# EasyEDA Pro project Schematic.epro

# Schematic Schematic1
Board Name: Board1; Create Date: 2026-04-01; Page Name: P1; Project Name: Microphone; Schematic Name: Schematic1; Update Date: 2026-04-01; Company: EasyEDA.com; Page Size: A4; Version: V1.0
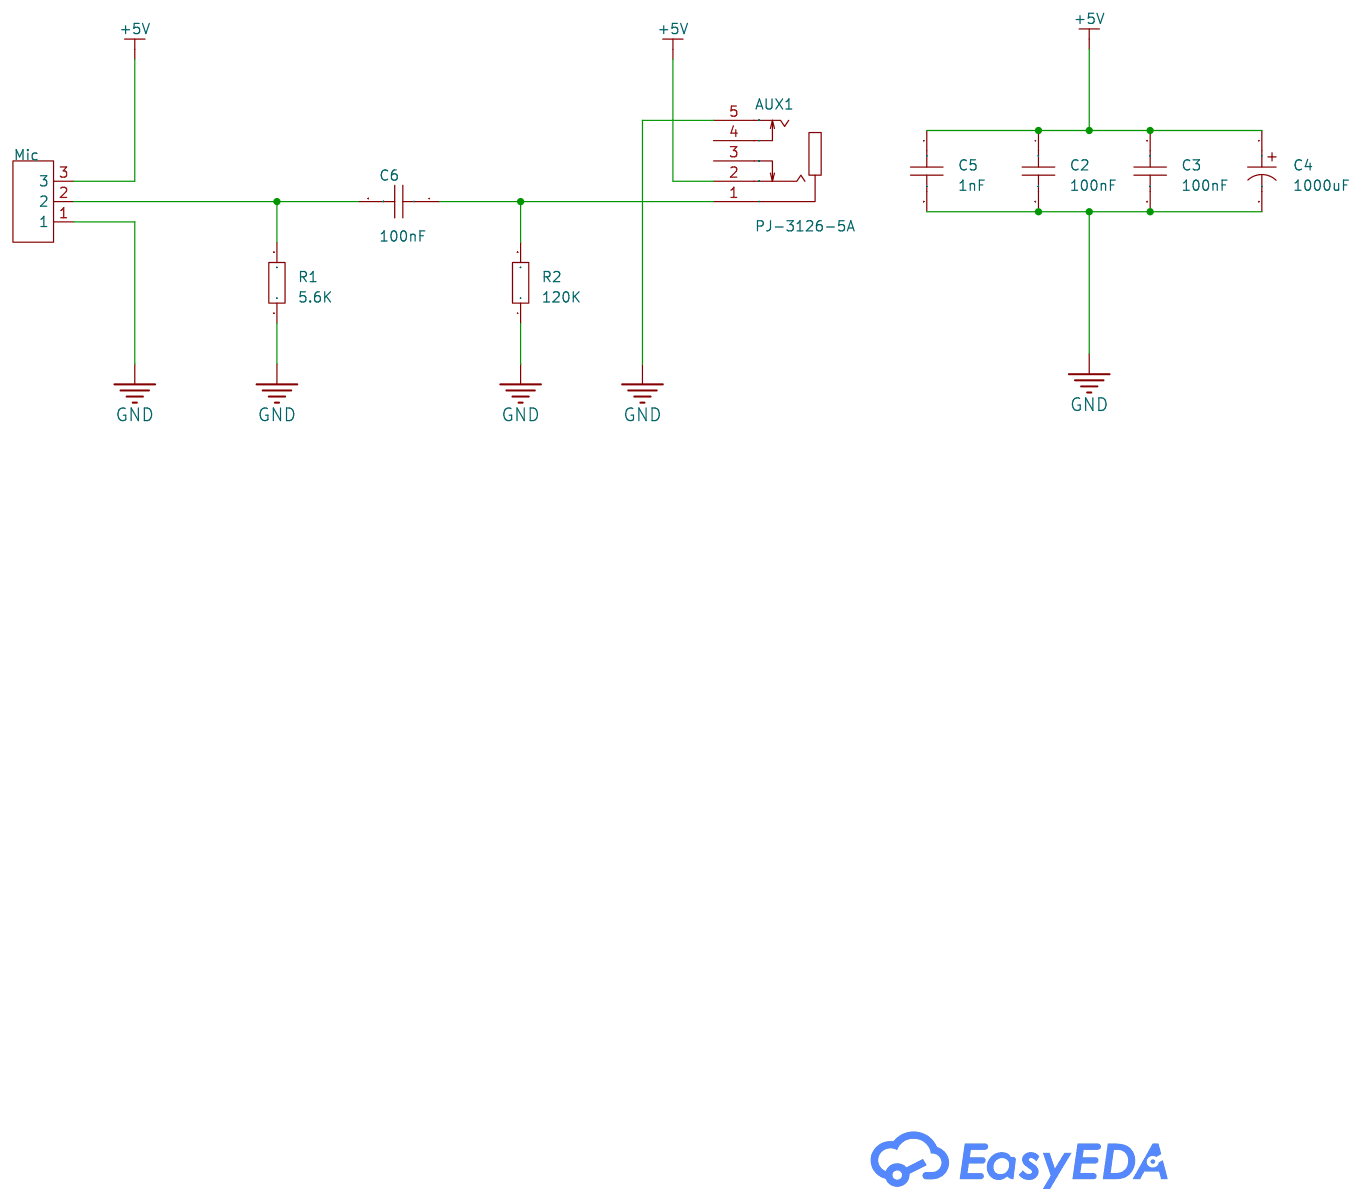
[diagram p0: schematic sheet]

## Parts
AUX1  PJ-3126-5A  [AUDIO-TH_PJ-3126-5A]
C2  100nF  [C0805]
C3  100nF  [C0805]
C4  1000uF  [CAP-TH_BD10.0-P5.00-D0.6-FD]
C5  1nF  [C0805]
C6  100nF  [C0805]
Mic  -  [HDR-TH_3P-P2.54-V-F]
R1  5.6K  [R0805]
R2  120K  [R0805]

## Library data of the parts
AUX1 = PJ-3126-5A: Connector Type:3.5mm Headphone Jack Current Rating:500mA Voltage Rating (Max):30V Contact Material:Phosphor Bronze Contact Plating:Gold; LCSC Part Name: 3.5mm耳机座; Supplier Part: C145816; Manufacturer: 韩国韩荣; Supplier Footprint: 插件; JLCPCB Part Class: Extended Part; Datasheet: https://item.szlcsc.com/datasheet/PJ-3126-5A/157148.html; Supplier: LCSC; Connector Type: 3.5mm Headphone Jack; Current Rating: 500mA; Voltage Rating (Max): 30V; Contact Material: Phosphor Bronze; Contact Plating: Gold
C2 C3 C5 C6 = CAP_0805: Supplier Footprint: 0805
C4 = RD1C108M10016PA160: Capacitance:1000uF Tolerance:±20% Tolerance:±20% Voltage Rating:16V Diameter:10mm Lifetime:2000hrs@85℃ Operating Temperature:-40℃~+85℃ Operating Temperature:-40℃~+85℃; LCSC Part Name: 1000uF ±20% 16V; Supplier Part: C18214323; Manufacturer: SAMWHA(三和); Supplier Footprint: 插件; JLCPCB Part Class: Extended Part; Datasheet: https://item.szlcsc.com/datasheet/RD1C108M10016PA160/19392828.html; Supplier: LCSC; Tolerance: ±20%; Voltage Rating: 16V; Diameter: 10mm; Lifetime: 2000hrs@85℃; Operating Temperature: -40℃~+85℃
Mic = HDR-F_2.54_1x3P: Supplier Footprint: Through
R1 R2 = Res_0805: Supplier Footprint: 0805

## Nets
+5V: AUX1.2 C2.1 C3.1 C4.1 C5.1 Mic.3
GND: AUX1.5 C2.2 C3.2 C4.2 C5.2 Mic.1 R1.1 R2.1
Net-(AUX1-1): AUX1.1 C6.1 R2.2
Net-(C6-2): C6.2 Mic.2 R1.2

Not connected (* = marked no-connect by the designer): AUX1 3 4
